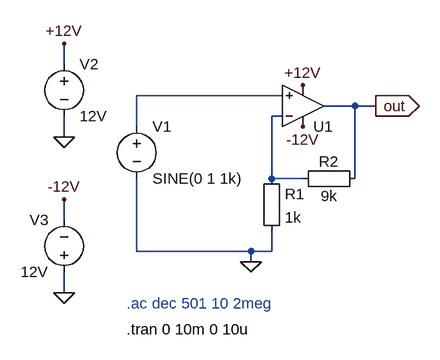
[diagram p0: schematic inverting_ampl.asc]
inverting_ampl.asc, the LTspice schematic file:
Version 4
SHEET 1 880 696
WIRE 96 272 96 240
WIRE 432 320 208 320
WIRE 544 336 496 336
WIRE 576 336 544 336
WIRE 432 352 416 352
WIRE 208 368 208 320
WIRE 96 384 96 352
WIRE 416 448 416 352
WIRE 464 448 416 448
WIRE 544 448 544 336
WIRE 96 512 96 480
WIRE 208 560 208 448
WIRE 384 560 208 560
WIRE 416 560 416 528
WIRE 416 560 384 560
WIRE 384 576 384 560
WIRE 96 624 96 592
FLAG 384 576 0
FLAG 576 336 out
IOPIN 576 336 Out
FLAG 96 624 0
FLAG 96 384 0
FLAG 96 480 -12V
FLAG 96 240 +12V
FLAG 464 304 +12V
FLAG 464 368 -12V
SYMBOL voltage 208 352 R0
SYMATTR InstName V1
SYMATTR Value SINE(0 1 1k)
SYMATTR Value2 AC 1 0
SYMBOL Opamps/UniversalOpamp2 464 336 M180
SYMATTR InstName U1
SYMBOL voltage 96 256 R0
SYMATTR InstName V2
SYMATTR Value 12V
SYMBOL voltage 96 608 R180
WINDOW 0 24 96 Left 2
WINDOW 3 24 16 Left 2
SYMATTR InstName V3
SYMATTR Value 12V
SYMBOL Misc/EuropeanResistor 400 432 R0
SYMATTR InstName R1
SYMATTR Value 1k
SYMBOL Misc/EuropeanResistor 560 432 R90
WINDOW 0 5 56 VBottom 2
WINDOW 3 27 56 VTop 2
SYMATTR InstName R2
SYMATTR Value 9k
TEXT 192 640 Left 2 ;.ac dec 501 10 2meg
TEXT 192 680 Left 2 !.tran 0 10m 0 10u

The netlist it stands for:
* inverting_ampl.asc
V1 N001 0 SINE(0 1 1k) AC 1 0
XU1 N001 N002 -12V +12V out level.2 Avol=1Meg GBW=10Meg Slew=10Meg ilimit=25m rail=0 Vos=0 phimargin=45 en=0 enk=0 in=0 ink=0 Rin=500Meg  ; pins IN+ IN- V+ V- OUT
V2 +12V 0 12V
V3 0 -12V 12V
R1 N002 0 1k
R2 out N002 9k
* .ac dec 501 10 2meg
.tran 0 10m 0 10u
.lib UniversalOpamps2.sub
.backanno
.end